# EAGLE design dspic (EAGLE 7.7.0)
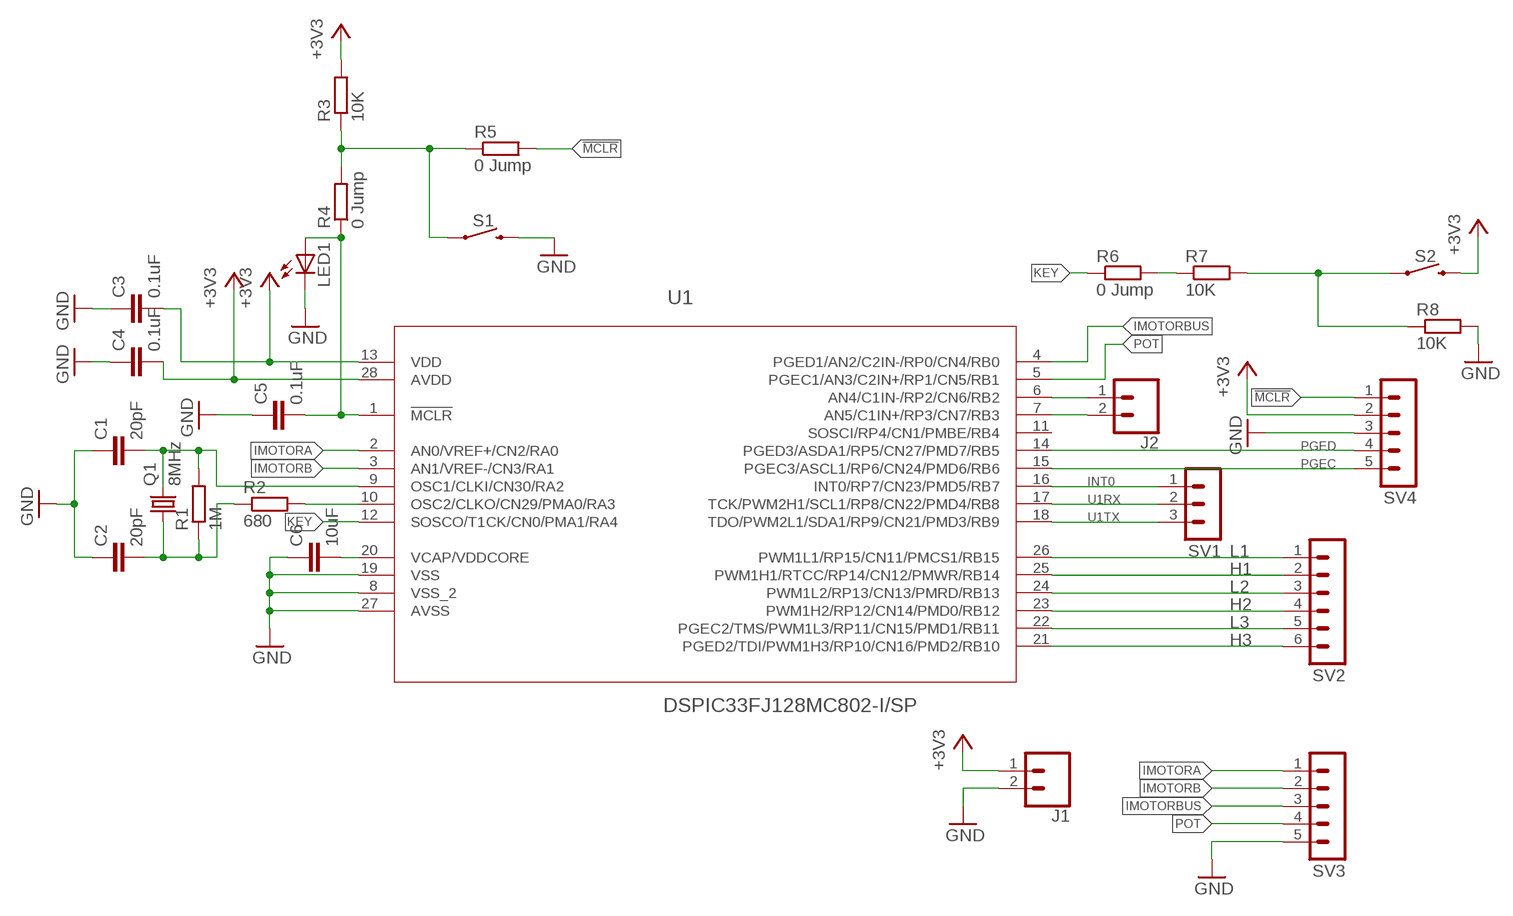
[diagram p0: schematic, sheet 1]

## Parts
C1  20pF  C-EU025-024X044  [C025-024X044]
C2  20pF  C-EU025-024X044  [C025-024X044]
C3  0.1uF  C-EU025-024X044  [C025-024X044]
C4  0.1uF  C-EU025-024X044  [C025-024X044]
C5  0.1uF  C-EU025-024X044  [C025-024X044]
C6  10uF  C-EU025-024X044  [C025-024X044]
J1  CONN_02  [1X02]
J2  CONN_02  [1X02]
LED1  LED3MM  [LED3MM]
Q1  8MHz  CRYSTALHC49S  [HC49/S]
R1  1M  R-EU_0207/10  [0207/10]
R2  680  R-EU_0207/10  [0207/10]
R3  10K  R-EU_0207/10  [0207/10]
R4  0 Jump  R-EU_0207/10  [0207/10]
R5  0 Jump  R-EU_0207/10  [0207/10]
R6  0 Jump  R-EU_0207/10  [0207/10]
R7  10K  R-EU_0207/10  [0207/10]
R8  10K  R-EU_0207/10  [0207/10]
S1  MOMENTARY-SWITCH-SPST-PTH-6.0MM  [TACTILE_SWITCH_PTH_6.0MM]
S2  MOMENTARY-SWITCH-SPST-PTH-6.0MM  [TACTILE_SWITCH_PTH_6.0MM]
SV1  MA03-1  [MA03-1]
SV2  MA06-1  [MA06-1]
SV3  MA05-1  [MA05-1]
SV4  MA05-1  [MA05-1]
U1  DSPIC33FJ128MC802-I/SP  [DIP254P762X508-28]

## Nets
!MCLR!: R5.2 SV4.1
+3V3: C3.2 C4.2 J1.1 R3.2 S2.3 SV4.2 U1.13(VDD) U1.28(AVDD)
GND: C1.1 C2.1 C3.1 C4.1 C5.1 C6.1 J1.2 LED1.K(C) R8.2 S1.3 SV3.5 SV4.3 U1.8(VSS_2) U1.19(VSS) U1.27(AVSS)
H1: SV2.2 U1.25(PWM1H1/RTCC/RP14/CN12/PMWR/RB14)
H2: SV2.4 U1.23(PWM1H2/RP12/CN14/PMD0/RB12)
H3: SV2.6 U1.21(PGED2/TDI/PWM1H3/RP10/CN16/PMD2/RB10)
IMOTORA: SV3.1 U1.2(AN0/VREF+/CN2/RA0)
IMOTORB: SV3.2 U1.3(AN1/VREF-/CN3/RA1)
IMOTORBUS: SV3.3 U1.4(PGED1/AN2/C2IN-/RP0/CN4/RB0)
INT0: SV1.1 U1.16(INT0/RP7/CN23/PMD5/RB7)
KEY: R6.1 U1.12(SOSCO/T1CK/CN0/PMA1/RA4)
L1: SV2.1 U1.26(PWM1L1/RP15/CN11/PMCS1/RB15)
L2: SV2.3 U1.24(PWM1L2/RP13/CN13/PMRD/RB13)
L3: SV2.5 U1.22(PGEC2/TMS/PWM1L3/RP11/CN15/PMD1/RB11)
N$1: C6.2 U1.20(VCAP/VDDCORE)
N$2: C5.2 LED1.A R4.1 U1.1(!MCLR!)
N$3: R7.2 R8.1 S2.1
N$4: R3.1 R4.2 R5.1 S1.1
N$6: R6.2 R7.1
N$7: C1.2 Q1.2 R1.2 U1.9(OSC1/CLKI/CN30/RA2)
N$8: C2.2 Q1.1 R1.1 R2.1
N$9: R2.2 U1.10(OSC2/CLKO/CN29/PMA0/RA3)
N$10: J2.1 U1.6(AN4/C1IN-/RP2/CN6/RB2)
N$11: J2.2 U1.7(AN5/C1IN+/RP3/CN7/RB3)
PGEC: SV4.5 U1.15(PGEC3/ASCL1/RP6/CN24/PMD6/RB6)
PGED: SV4.4 U1.14(PGED3/ASDA1/RP5/CN27/PMD7/RB5)
POT: SV3.4 U1.5(PGEC1/AN3/C2IN+/RP1/CN5/RB1)
U1RX: SV1.2 U1.17(TCK/PWM2H1/SCL1/RP8/CN22/PMD4/RB8)
U1TX: SV1.3 U1.18(TDO/PWM2L1/SDA1/RP9/CN21/PMD3/RB9)
Unconnected: U1.11(SOSCI/RP4/CN1/PMBE/RB4)

## Library data of the parts
C1-C6 = resistor:C-EU: CAPACITOR, European symbol
J1 J2 = SparkFun-Connectors:CONN_02: Multi connection point. Often used as Generic Header-pin footprint for 0.1 inch spaced/style header connections On any of the 0.1 inch spaced packages, you can populate with these: Break Away Headers - Straight <https://www.sparkfun.com/products/116> (PRT-00116) Break Away Male Headers - Right Angle <https://www.sparkfun.com/products/553> (PRT-00553) Female Headers <https://www.sparkfun.com/products/115> (PRT-00115) Break Away Headers - Machine Pin <https://www.sparkfun.com/products/117> (PRT-00117) Break Away Female Headers - Swiss Machine Pin <https://www.sparkfun.com/products/743> (PRT-00743) For SCREWTERMINALS and SPRING TERMINALS visit here: Screw Terimnals on SparkFun.com <https://www.sparkfun.com/search/results?term=Screw+Terminals> (5mm/3.5mm/2.54mm spacing) This device is also useful as a general connection point to wire up your design to another part of your project. Our various solder wires solder well into these plated through hole pads. Hook-Up Wire - Assortment (Stranded, 22 AWG) <https://www.sparkfun.com/products/11375> (PRT-11375) Hook-Up Wire - Assortment (Solid Core, 22 AWG) <https://www.sparkfun.com/products/11367> (PRT-11367) View the entire wire category on our website here <https://www.sparkfun.com/categories/141> Special notes: Molex polarized connector foot print use with: PRT-08233 with associated crimp pins and housings. 2.54_SCREWTERM for use with PRT-10571. 3.5mm Screw Terminal footprints for PRT-08084 5mm Screw Terminal footprints for use with PRT-08432
LED1 = led:LED: LED OSRAM: - CHIPLED LG R971, LG N971, LY N971, LG Q971, LY Q971, LO R971, LY R971 LH N974, LH R974 LS Q976, LO Q976, LY Q976 LO Q996 - Hyper CHIPLED LW Q18S LB Q993, LB Q99A, LB R99A - SideLED LS A670, LO A670, LY A670, LG A670, LP A670 LB A673, LV A673, LT A673, LW A673 LH A674 LY A675 LS A676, LA A676, LO A676, LY A676, LW A676 LS A679, LY A679, LG A679 - Hyper Micro SIDELED® LS Y876, LA Y876, LO Y876, LY Y876 LT Y87S - SmartLED LW L88C, LW L88S LB L89C, LB L89S, LG L890 LS L89K, LO L89K, LY L89K LS L896, LA L896, LO L896, LY L896 - TOPLED LS T670, LO T670, LY T670, LG T670, LP T670 LSG T670, LSP T670, LSY T670, LOP T670, LYG T670 LG T671, LOG T671, LSG T671 LB T673, LV T673, LT T673, LW T673 LH T674 LS T676, LA T676, LO T676, LY T676, LB T676, LH T676, LSB T676, LW T676 LB T67C, LV T67C, LT T67C, LS T67K, LO T67K, LY T67K, LW E67C LS E67B, LA E67B, LO E67B, LY E67B, LB E67C, LV E67C, LT E67C LW T67C LS T679, LY T679, LG T679 LS T770, LO T770, LY T770, LG T770, LP T770 LB T773, LV T773, LT T773, LW T773 LH T774 LS E675, LA E675, LY E675, LS T675 LS T776, LA T776, LO T776, LY T776, LB T776 LHGB T686 LT T68C, LB T68C - Hyper Mini TOPLED® LB M676 - Mini TOPLED Santana® LG M470 LS M47K, LO M47K, LY M47K Source: http://www.osram.convergy.de LUXEON: - LUMILED® LXK2-PW12-R00, LXK2-PW12-S00, LXK2-PW14-U00, LXK2-PW14-V00 LXK2-PM12-R00, LXK2-PM12-S00, LXK2-PM14-U00 LXK2-PE12-Q00, LXK2-PE12-R00, LXK2-PE12-S00, LXK2-PE14-T00, LXK2-PE14-U00 LXK2-PB12-K00, LXK2-PB12-L00, LXK2-PB12-M00, LXK2-PB14-N00, LXK2-PB14-P00, LXK2-PB14-Q00 LXK2-PR12-L00, LXK2-PR12-M00, LXK2-PR14-Q00, LXK2-PR14-R00 LXK2-PD12-Q00, LXK2-PD12-R00, LXK2-PD12-S00 LXK2-PH12-R00, LXK2-PH12-S00 LXK2-PL12-P00, LXK2-PL12-Q00, LXK2-PL12-R00 Source: www.luxeon.com KINGBRIGHT: KA-3528ASYC Source: www.kingbright.com
Q1 = crystal:CRYSTAL: CRYSTAL; OC_FARNELL: 1667008; OC_NEWARK: unknown
R1-R8 = resistor:R-EU_: RESISTOR, European symbol
S1 S2 = SparkFun-Switches:MOMENTARY-SWITCH-SPST: Momentary Switch (Pushbutton) - SPST Normally-open (NO) SPST momentary switches (buttons, pushbuttons). Variants PTH-12MM - 12mm square, through-hole Momentary Pushbutton Switch - 12mm Square <https://www.sparkfun.com/products/9190> (COM-09190) PTH-6.0MM, PTH-6.0MM-KIT - 6.0mm square, through-hole Mini Pushbutton Switch <https://www.sparkfun.com/products/97> (COM-00097) KIT package intended for soldering kit's - only one side of pads' copper is exposed. PTH-RIGHT-ANGLE-KIT - Right-angle, through-hole Right Angle Tactile Button <https://www.sparkfun.com/products/10791> - Used on SparkFun BigTime Watch Kit <https://www.sparkfun.com/products/11734> SMD-12MM - 12mm square, surface-mount Tactile Button - SMD (12mm) <https://www.sparkfun.com/products/12993> (COM-12993) Used on SparkFun PicoBoard <https://www.sparkfun.com/products/11888> SMD-4.5MM - 4.5mm Square Trackball Switch Used on SparkFun Blackberry Trackballer Breakout <https://www.sparkfun.com/products/13169> SMD-4.6MMX2.8MM - 4.60mm x 2.80mm, surface mount Used on SparkFun SAMD21 Mini Breakout <https://www.sparkfun.com/products/13664> SMD-5.2MM, SMD-5.2-REDUNDANT - 5.2mm square, surface-mount Mini Pushbutton Switch - SMD <https://www.sparkfun.com/products/8720> (COM-08720) Used on Arduino Pro Mini <https://www.sparkfun.com/products/11114> REDUNDANT package connects both switch circuits together SMD-6.0X3.5MM - 6.0 x 3.5mm, surface mount Momentary Reset Switch SMD <https://www.sparkfun.com/products/8229> (COM-08229) SMD-6.2MM-TALL - 6.2mm square, surface mount Tactile Button - SMD (6mm) <https://www.sparkfun.com/products/12992> Used on SparkFun Digital Sandbox <https://www.sparkfun.com/products/12651> SMD-RIGHT-ANGLE - Right-angle, surface mount Used on SparkFun Block for Intel® Edison - Arduino <https://www.sparkfun.com/products/13036>; PROD_ID: SWCH-08441; SF_SKU: COM-00097
SV1 = con-lstb:MA03-1: PIN HEADER; OC_FARNELL: unknown; OC_NEWARK: unknown
SV2 = con-lstb:MA06-1: PIN HEADER; OC_FARNELL: unknown; OC_NEWARK: unknown
SV3 SV4 = con-lstb:MA05-1: PIN HEADER; OC_FARNELL: unknown; OC_NEWARK: unknown
U1 = Microchip-DSPIC33FJ128MC802-I_SP:DSPIC33FJ128MC802-I/SP: 16-Bit Digital Signal Controllers; DESCRIPTION: IC, DSC; MPN: DSPIC33FJ128MC802-I/SP; OC_FARNELL: 1576808; OC_NEWARK: 39M8141; PACKAGE: DIP-28; SUPPLIER: Microchip

## Net classes
0 default: width 1.27 mm, drill 1 mm

## Board
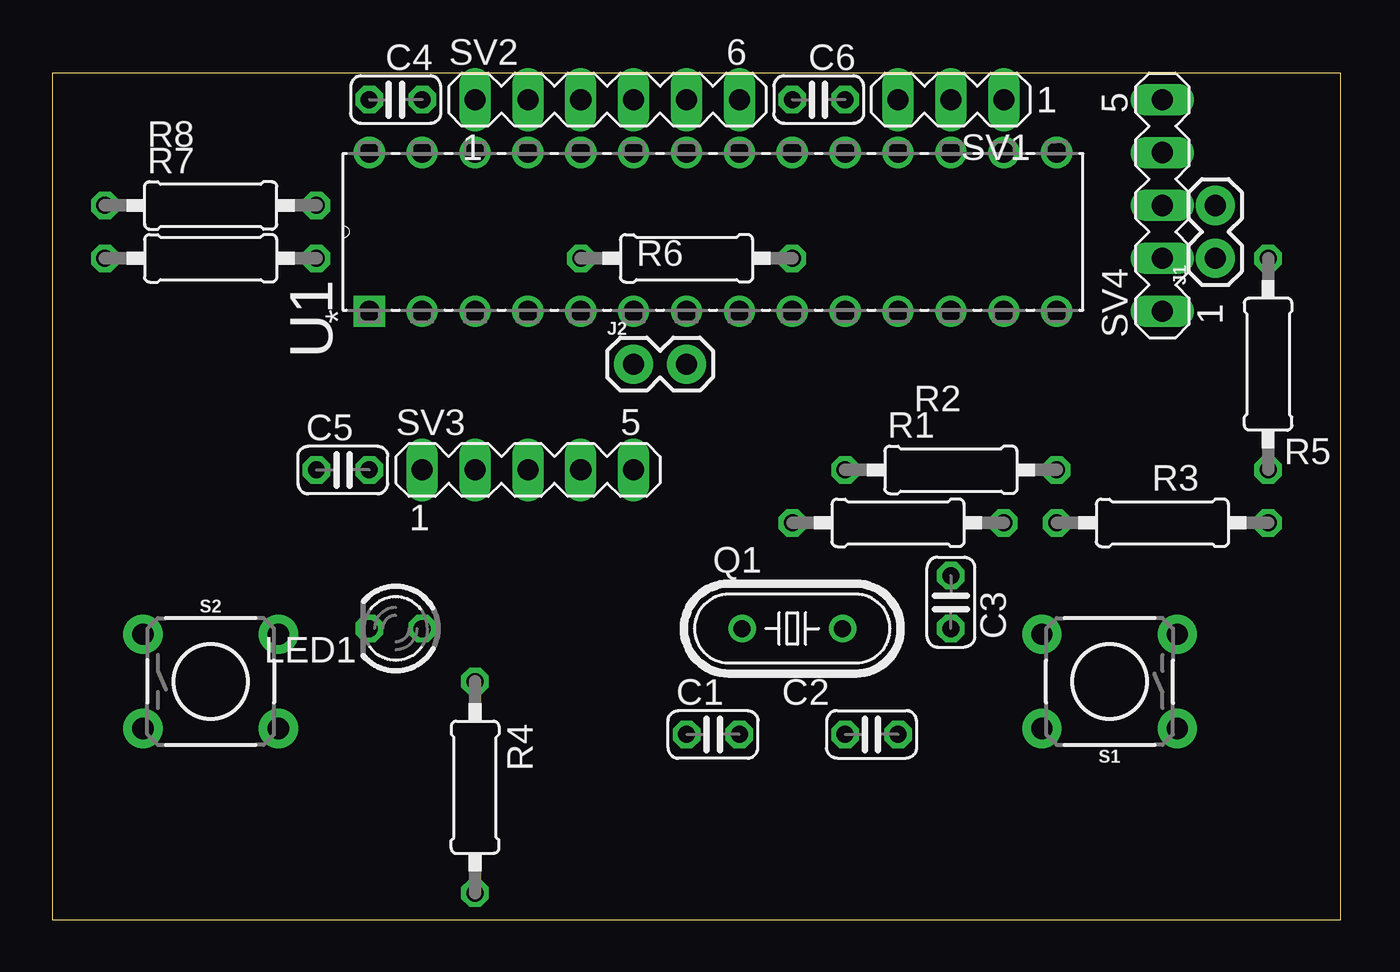
[diagram p1: board, top side]
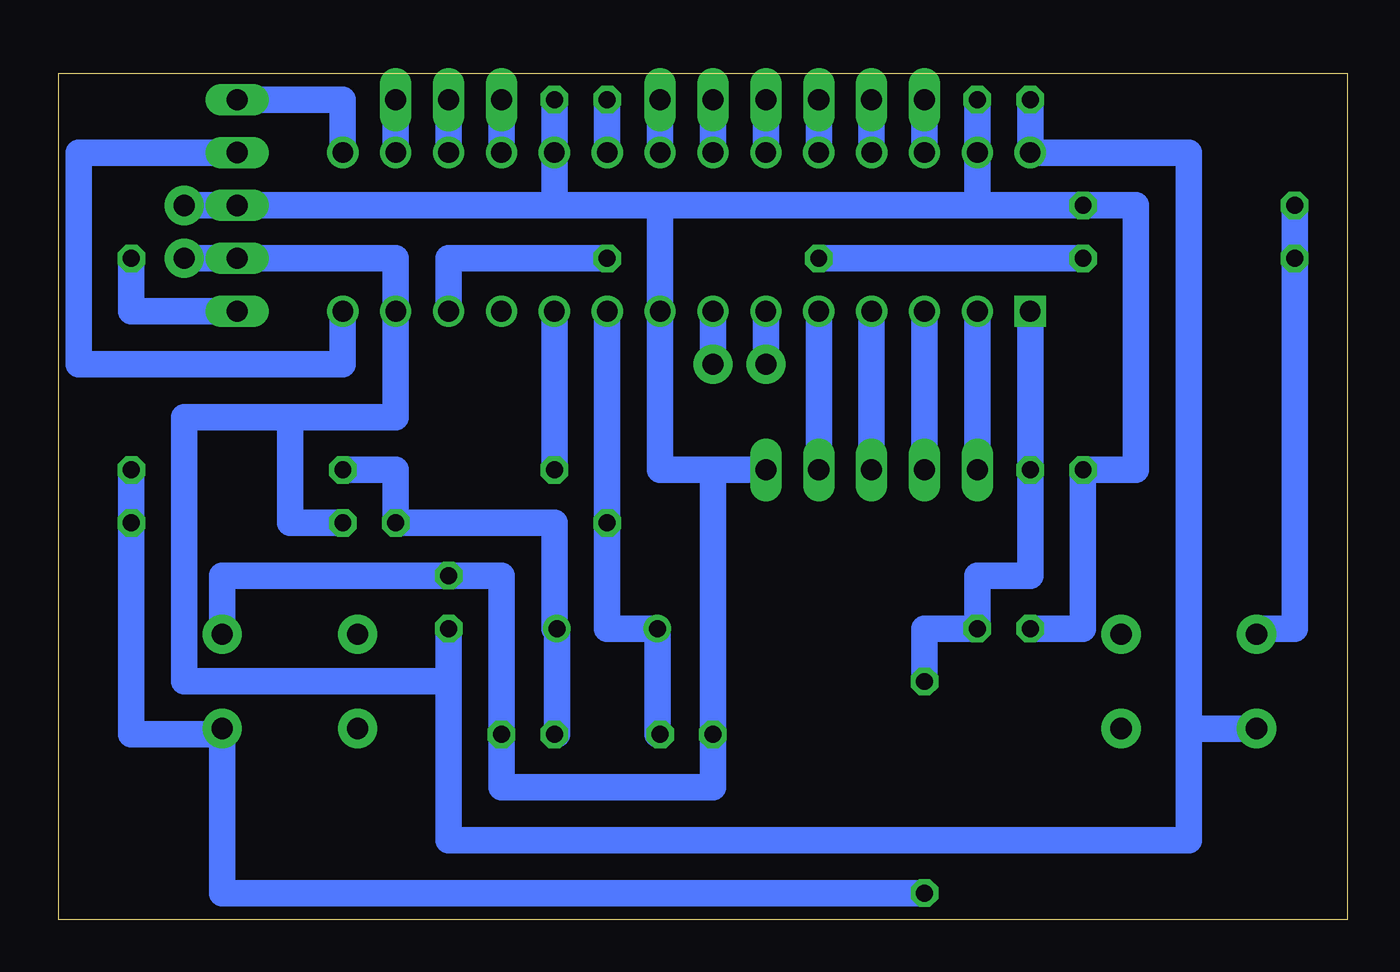
[diagram p2: board, bottom side, seen from below]

Size 61.9 x 40.63 mm. Coordinates in mm from the lower left corner, seen from the top.
Outline: 0,0 61.9,0 61.9,40.63 0,40.63 0,0
Copper layers (1*16): Top 0.035mm / dielectric 1.5mm / Bottom 0.035mm
Design rules "default": minimum track width 10mil, minimum drill 24mil, track to track 8mil, track to pad 8mil, pad to pad 8mil, via to via 8mil, smd to smd 8mil, copper to edge 40mil, drill to drill 8mil, minimum pad ring 10mil, minimum via ring 8mil, stop-mask expansion 4mil, vias tented up to drill 0mil, thermal gap 10mil

### Footprints (pad centres in the part's own frame; a part is rotated, then mirrored left to right if it is on the bottom)
C025-024X044 = drill 0.813 octagon: 1 -1.27,0; 2 1.27,0
1X02 = drill 1.016 pad 1.88: 1 0,0; 2 2.54,0
LED3MM = drill 0.813 octagon: A -1.27,0; K 1.27,0
HC49/S = drill 0.813: 1 -2.413,0; 2 2.413,0
0207/10 = drill 0.813 octagon: 1 -5.08,0; 2 5.08,0
TACTILE_SWITCH_PTH_6.0MM = drill 1.016 pad 1.88: 1 -3.251,2.261; 2 3.251,2.261; 3 -3.251,-2.261; 4 3.251,-2.261
MA03-1 = drill 1.016 long: 1 -2.54,0; 2 0,0; 3 2.54,0
MA06-1 = drill 1.016 long: 1 -6.35,0; 2 -3.81,0; 3 -1.27,0; 4 1.27,0; 5 3.81,0; 6 6.35,0
MA05-1 = drill 1.016 long: 1 -5.08,0; 2 -2.54,0; 3 0,0; 4 2.54,0; 5 5.08,0
DIP254P762X508-28 = drill 0.991 square: 1 -3.81,16.51 | drill 0.991: 2 -3.81,13.97; 3 -3.81,11.43; 4 -3.81,8.89; 5 -3.81,6.35; 6 -3.81,3.81; 7 -3.81,1.27; 8 -3.81,-1.27; 9 -3.81,-3.81; 10 -3.81,-6.35; 11 -3.81,-8.89; 12 -3.81,-11.43; 13 -3.81,-13.97; 14 -3.81,-16.51; 15 3.81,-16.51; 16 3.81,-13.97; 17 3.81,-11.43; 18 3.81,-8.89; 19 3.81,-6.35; 20 3.81,-3.81; 21 3.81,-1.27; 22 3.81,1.27; 23 3.81,3.81; 24 3.81,6.35; 25 3.81,8.89; 26 3.81,11.43; 27 3.81,13.97; 28 3.81,16.51

### Placement (x,y rotation side)
C1  31.75,8.89 0 top
C2  39.37,8.89 180 top
C3  43.18,15.24 270 top
C4  16.51,39.37 180 top
C5  13.97,21.59 0 top
C6  36.83,39.37 180 top
J1  55.88,31.75 90 top
J2  27.94,26.67 0 top
LED1  16.51,13.97 180 top
Q1  35.56,13.97 180 top
R1  40.64,19.05 180 top
R2  43.18,21.59 180 top
R3  53.34,19.05 180 top
R4  20.32,6.35 270 top
R5  58.42,26.67 90 top
R6  30.48,31.75 180 top
R7  7.62,31.75 180 top
R8  7.62,34.29 0 top
S1  50.8,11.43 180 top
S2  7.62,11.43 0 top
SV1  43.18,39.37 180 top
SV2  26.67,39.37 0 top
SV3  22.86,21.59 0 top
SV4  53.34,34.29 90 top
U1  31.75,33.02 90 top

### Tracks (layer width: path | path; a pad name or v marks a point on that pad's centre or on a via)
!MCLR!
  Bottom 1.27: SV4.1 58.42,29.21 R5.2
+3V3
  Bottom 1.27: C4.2 U1.28 7.62,36.83 7.62,9.17 | 7.62,9.17 7.62,3.81 43.18,3.81 43.18,11.43 | S2.3 7.62,9.17 | 50.8,24.13 55.88,24.13 55.88,11.43 43.18,11.43 | 50.8,24.13 45.72,24.13 U1.13 45.72,31.75 SV4.2 J1.1 | R3.2 50.8,19.05 50.8,24.13 | C3.2 43.18,11.43
GND
  Bottom 1.27: 30.48,21.59 SV3.5 | 33.02,34.29 U1.8 33.02,21.59 30.48,21.59 | 33.02,34.29 38.1,34.29 | 38.1,34.29 SV4.3 J1.2 | 38.1,34.29 U1.19 C6.1 | 17.78,34.29 U1.27 C4.1 | 17.78,34.29 33.02,34.29 | 17.78,34.29 R8.2 10.16,34.29 10.16,21.59 C5.1 12.7,13.97 LED1.K | 30.48,21.59 C1.1 30.48,6.35 40.64,6.35 C2.1 40.64,16.51 C3.1 54.05,16.51 S1.3
H1
  Bottom 1.27: U1.25 SV2.2
H2
  Bottom 1.27: U1.23 SV2.4
H3
  Bottom 1.27: U1.21 SV2.6
IMOTORA
  Bottom 1.27: SV3.1 U1.2
IMOTORB
  Bottom 1.27: SV3.2 U1.3
IMOTORBUS
  Bottom 1.27: SV3.3 U1.4
INT0
  Bottom 1.27: U1.16 SV1.1
KEY
  Bottom 1.27: R6.1 43.18,31.75 U1.12
L1
  Bottom 1.27: U1.26 SV2.1
L2
  Bottom 1.27: U1.24 SV2.3
L3
  Bottom 1.27: U1.22 SV2.5
N$1
  Bottom 1.27: U1.20 C6.2
N$2
  Bottom 1.27: R4.1 20.32,13.97 LED1.A 17.78,16.51 15.24,16.51 C5.2 U1.1
N$3
  Bottom 1.27: R8.1 R7.2 2.54,13.97 4.37,13.97 S2.1
N$4
  Bottom 1.27: R4.2 54.05,1.27 54.05,8.89 | 54.05,8.89 S1.1 | 54.05,8.89 58.42,8.89 R3.1 R5.1
N$6
  Bottom 1.27: R7.1 R6.2
N$7
  Bottom 1.27: Q1.2 35.56,13.97 R1.2 U1.9 | Q1.2 34.29,13.97 | C1.2 33.15,8.89 Q1.2
N$8
  Bottom 1.27: R2.1 45.72,21.59 R1.1 38.1,19.05 38.1,13.97 Q1.1 37.97,8.89 C2.2
N$9
  Bottom 1.27: U1.10 R2.2
N$10
  Bottom 1.27: J2.1 U1.6
N$11
  Bottom 1.27: J2.2 U1.7
PGEC
  Bottom 1.27: U1.15 48.26,39.37 SV4.5
PGED
  Bottom 1.27: SV4.4 60.96,36.83 60.96,26.67 48.26,26.67 U1.14
POT
  Bottom 1.27: SV3.4 U1.5
U1RX
  Bottom 1.27: U1.17 SV1.2
U1TX
  Bottom 1.27: U1.18 SV1.3